# Altium schematic sheet SCH-esp32.SchDoc (part 1 of 3)
size A2; SheetNumber: 1; SheetTotal: 1
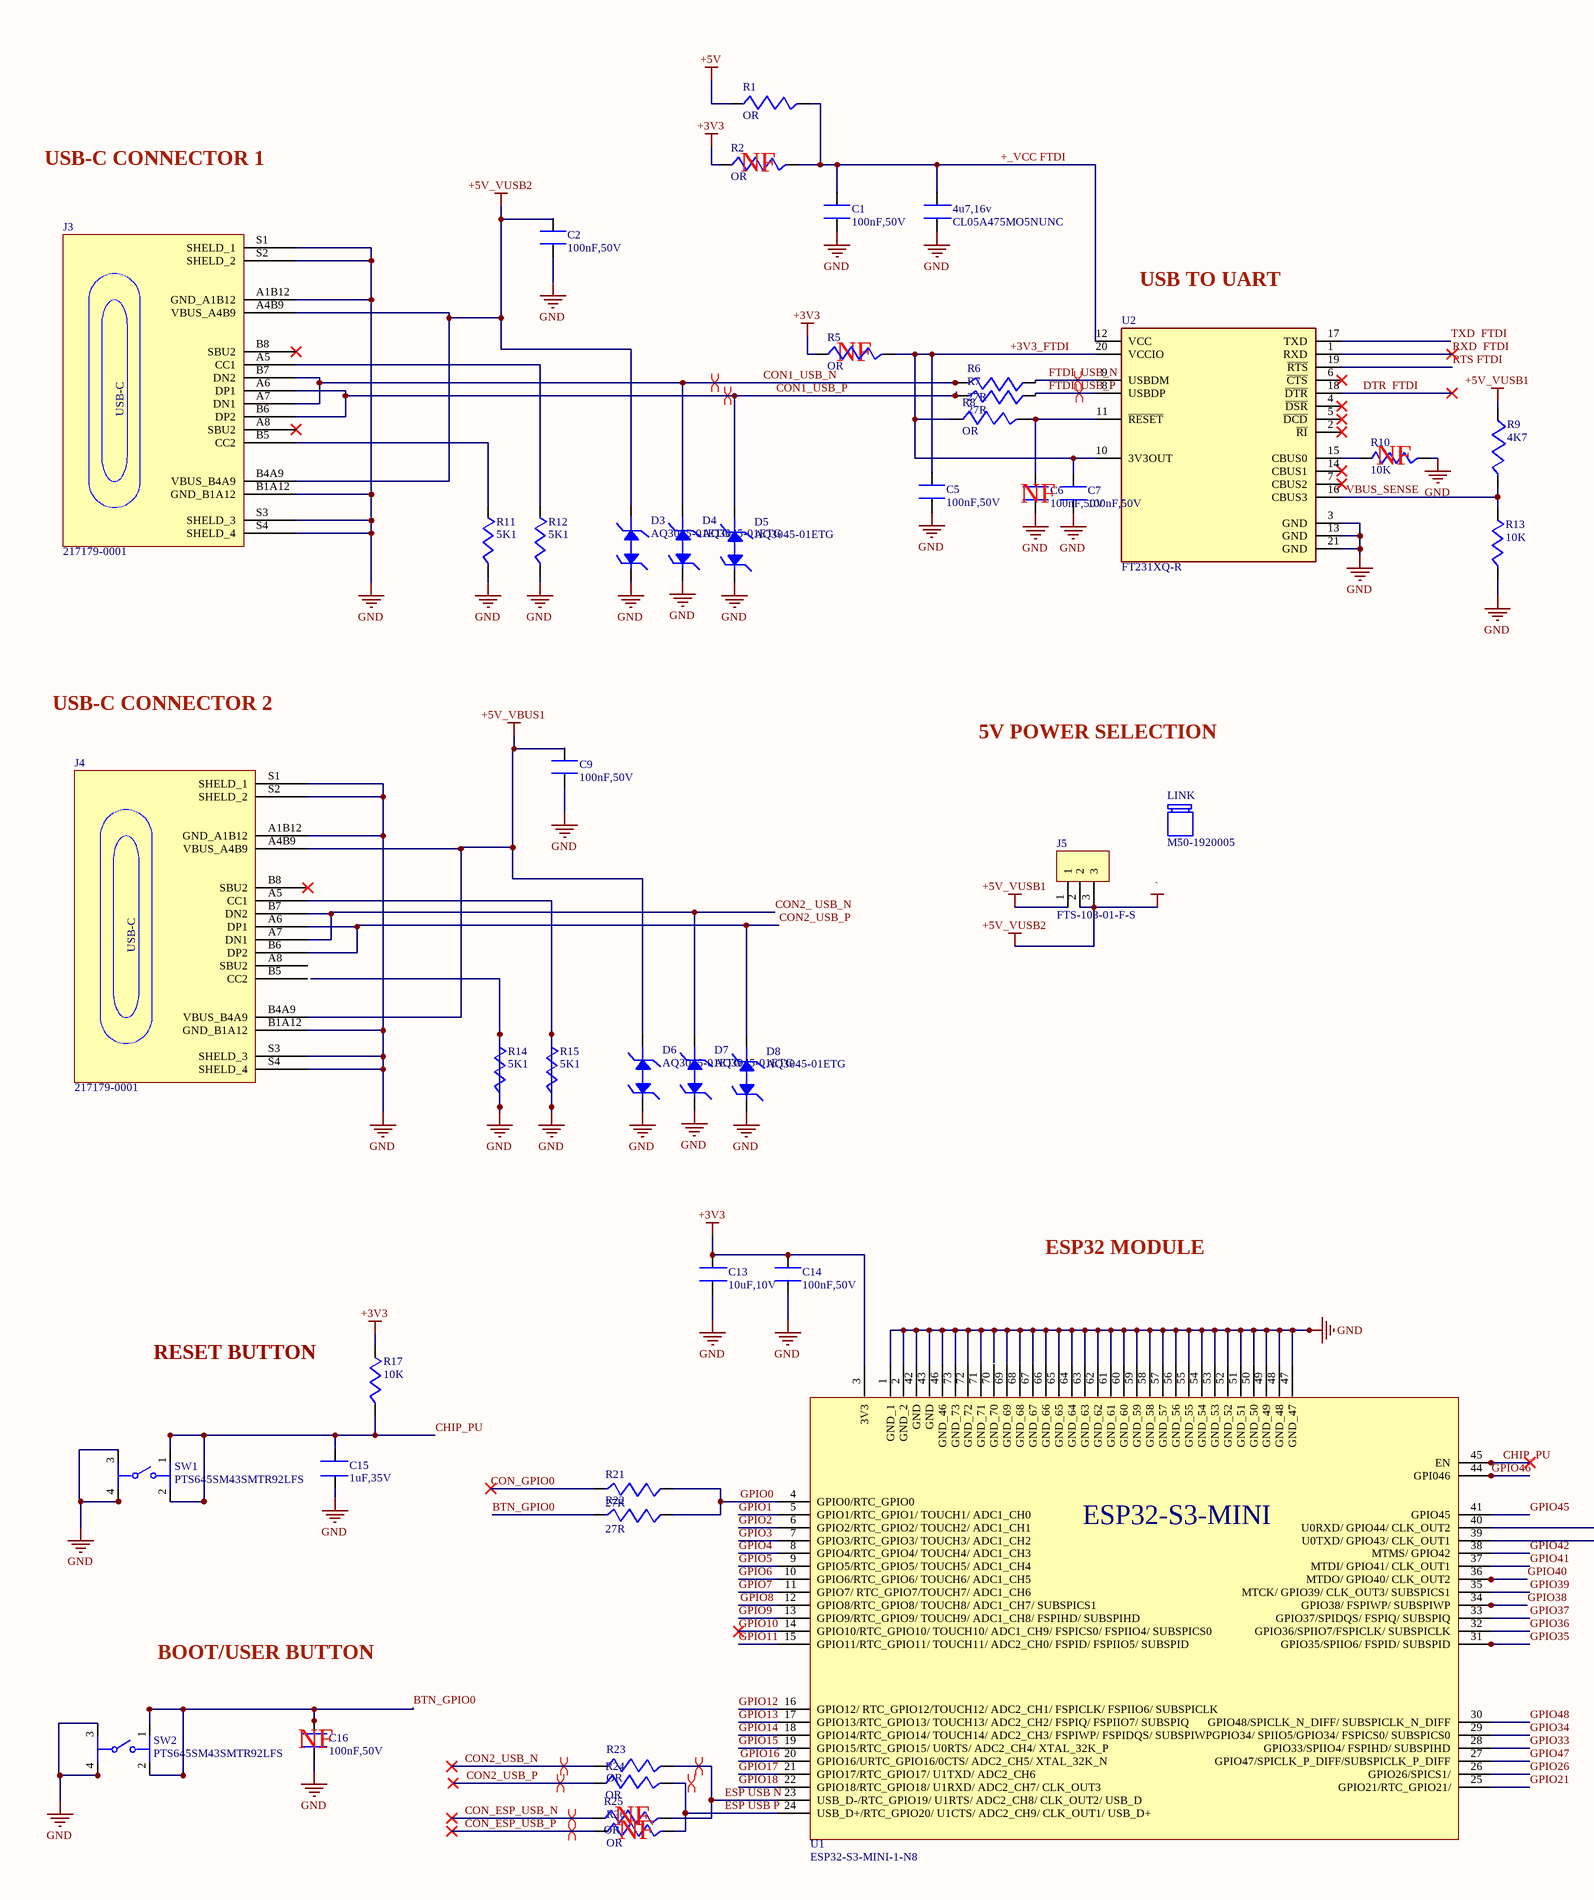
[diagram p0: SCH-esp32.SchDoc, left]
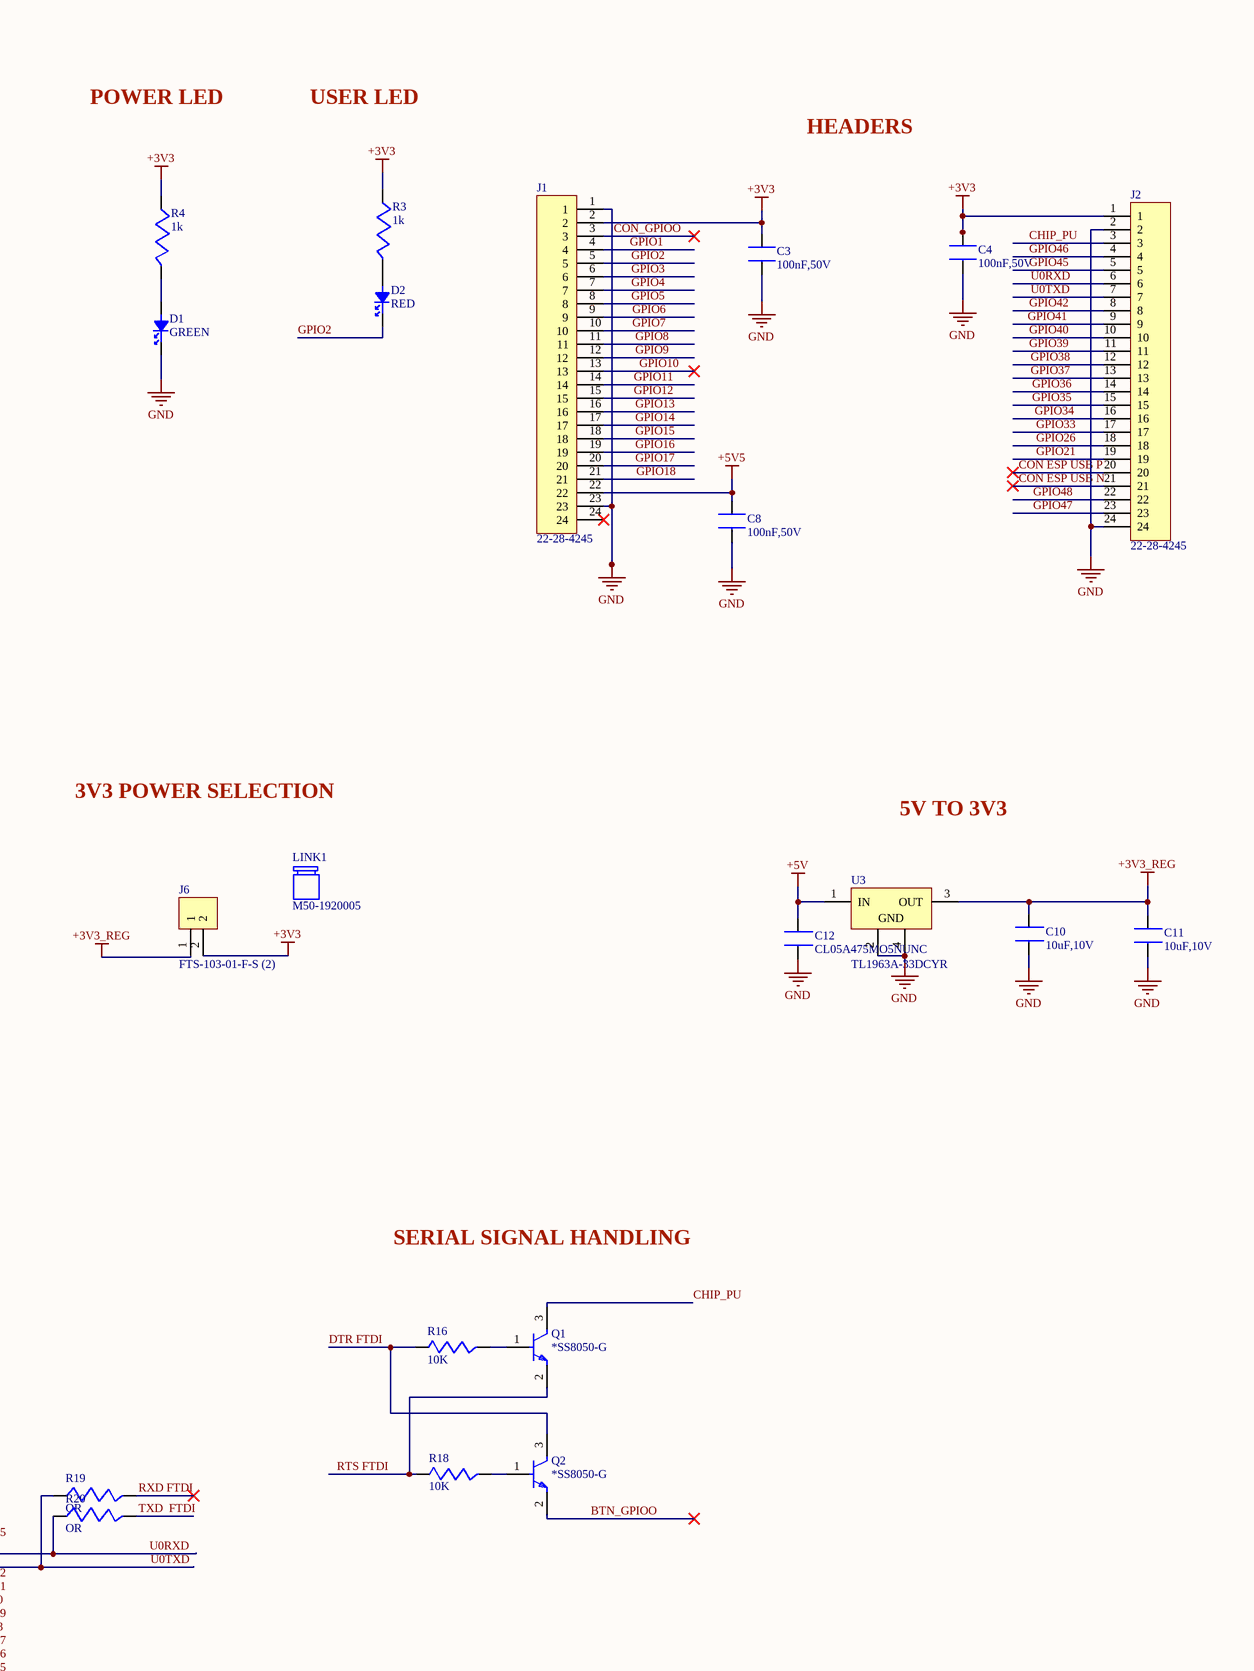
[diagram p1: SCH-esp32.SchDoc, right]

## Parts
4u7,16v  CL05A475MO5NUNC  [CAPC1005X55N]
C1  100nF,50V  [CAPC1005X55N]
C2  100nF,50V  [CAPC1005X55N]
C3  100nF,50V  [CAPC1005X55N]
C4  100nF,50V  [CAPC1005X55N]
C5  100nF,50V  [CAPC1005X55N]
C6  100nF,50V  [CAPC1005X55N]
C7  100nF,50V  [CAPC1005X55N]
C8  100nF,50V  [CAPC1005X55N]
C9  100nF,50V  [CAPC1005X55N]
C10  10uF,10V  [CAPC1005X55N]
C11  10uF,10V  [CAPC1005X55N]
C12  CL05A475MO5NUNC  [CAPC1005X55N]
C13  10uF,10V  [CAPC1005X55N]
C14  100nF,50V  [CAPC1005X55N]
C15  1uF,35V  [CAPC1005X55N]
C16  100nF,50V  [CAPC1005X55N]
D1  GREEN  [LED0402G]
D2  RED  [LED0402R]
D3  AQ3045-01ETG  [SOD882]
D4  AQ3045-01ETG  [SOD882]
D5  AQ3045-01ETG  [SOD882]
D6  AQ3045-01ETG  [SOD882]
D7  AQ3045-01ETG  [SOD882]
D8  AQ3045-01ETG  [SOD882]
J1  22-28-4245  [HDR_1X24_2.54MM]
J2  22-28-4245  [HDR_1X24_2.54MM]
J3  217179-0001  [FP-2171790001-MFG]
J4  217179-0001  [FP-2171790001-MFG]
J5  FTS-103-01-F-S  [HDR_1X3_1.27MM]
J6  FTS-103-01-F-S (2)  [HDR_1X2_1.27MM]
LINK  M50-1920005
LINK1  M50-1920005
Q1  *SS8050-G  [FP-SS8050-G-IPC_B]
Q2  *SS8050-G  [FP-SS8050-G-IPC_B]
R1  OR  [RESC1005X37N]
R2  OR  [RESC1005X37N]
R3  1k  [RESC1005X37N]
R4  1k  [RESC1005X37N]
R5  OR  [RESC1005X37N]
R6  27R  [RESC1005X37N]
R7  27R  [RESC1005X37N]
R8  OR  [RESC1005X37N]
R9  4K7  [RESC1005X37N]
R10  10K  [RESC1005X37N]
R11  5K1  [RESC1005X37N]
R12  5K1  [RESC1005X37N]
R13  10K  [RESC1005X37N]
R14  5K1  [RESC1005X37N]
R15  5K1  [RESC1005X37N]
R16  10K  [RESC1005X37N]
R17  10K  [RESC1005X37N]
R18  10K  [RESC1005X37N]
R19  OR  [RESC1005X37N]
R20  OR  [RESC1005X37N]
R21  27R  [RESC1005X37N]
R22  27R  [RESC1005X37N]
R23  OR  [RESC1005X37N]
R24  OR  [RESC1005X37N]
R25  OR  [RESC1005X37N]
R26  OR  [RESC1005X37N]
SW1  PTS645SM43SMTR92LFS  [FP-PTS645SH50SMTR92LFS-MFG]
SW2  PTS645SM43SMTR92LFS  [FP-PTS645SH50SMTR92LFS-MFG]
U1  ESP32-S3-MINI-1-N8  [XCVR_ESP32-S3-MINI-1-N8 - duplicate]
U2  FT231XQ-R  [FP-QFN-20-IPC_B]
U3  TL1963A-33DCYR  [DCY0004A_N]

## Nets
+3V3: C3.2 C4.2 C13.2 C14.2 J1.2 J2.1 J6.2 R2.2 R3.2 R4.2 R5.2 R17.2 U1.3(3V3)
+3V3_REG: C10.2 C11.2 J6.1 U3.3(OUT)
+5V: C12.2 R1.2 U3.1(IN)
+5V5: C8.2 J1.22
+5V_VBUS1: C9.2 D6.2 J4.A4B9(VBUS_A4B9) J4.B4A9(VBUS_B4A9)
+5V_VUSB1: J5.1 R9.2
+5V_VUSB2: C2.2 D3.2 J3.A4B9(VBUS_A4B9) J3.B4A9(VBUS_B4A9) J5.2 J5.3  [also labelled `]
GND: 4u7,16v.1 C1.1 C2.1 C3.1 C4.1 C5.1 C6.1 C7.1 C8.1 C9.1 C10.1 C11.1 C12.1 C13.1 C14.1 C15.1 C16.1 D1.1 D3.1 D4.1 D5.1 D6.1 D7.1 D8.1 J1.1 J1.23 J2.2 J2.24 J3.A1B12(GND_A1B12) J3.B1A12(GND_B1A12) J3.S1(SHELD_1) J3.S2(SHELD_2) J3.S3(SHELD_3) J3.S4(SHELD_4) J4.A1B12(GND_A1B12) J4.A5(CC1) J4.B1A12(GND_B1A12) J4.S1(SHELD_1) J4.S2(SHELD_2) J4.S3(SHELD_3) J4.S4(SHELD_4) R10.1 R11.1 R12.1 R13.1 R14.1 R14.2 R15.1 R15.2 SW1.3 SW1.4 SW2.3 SW2.4 U1.1(GND_1) U1.2(GND_2) U1.42(GND) U1.43(GND) U1.46(GND_46) U1.47(GND_47) U1.48(GND_48) U1.49(GND_49) U1.50(GND_50) U1.51(GND_51) U1.52(GND_52) U1.53(GND_53) U1.54(GND_54) U1.55(GND_55) U1.56(GND_56) U1.57(GND_57) U1.58(GND_58) U1.59(GND_59) U1.60(GND_60) U1.61(GND_61) U1.62(GND_62) U1.63(GND_63) U1.64(GND_64) U1.65(GND_65) U1.66(GND_66) U1.67(GND_67) U1.68(GND_68) U1.69(GND_69) U1.71(GND_71) U1.72(GND_72) U1.73(GND_73) U2.3(GND) U2.13(GND) U2.21(GND) U3.2(GND) U3.4(GND)
+3V3_FTDI: C5.2 C7.2 R5.1 R8.2 U2.10(3V3OUT) U2.20(VCCIO)
+_VCC FTDI: 4u7,16v.2 C1.2 R1.1 R2.1 U2.12(VCC)
BTN_GPIO0: C16.2 R22.1 SW2.1 SW2.2
BTN_GPIOO: Q2.2(E)
CHIP_PU: C15.2 J2.3 Q1.3(C) R17.1 SW1.1 SW1.2 U1.45(EN)
CON1_USB_N: D4.2 J3.A7(DN1) J3.B7(DN2) R6.1
CON1_USB_P: D5.2 J3.A6(DP1) J3.B6(DP2) R7.1
CON2_ USB_N: D7.2 J4.A7(DN1) J4.B7(DN2)
CON2_USB_N: R23.2
CON2_USB_P: D8.2 J4.A6(DP1) J4.B6(DP2) R24.2
CON ESP USB N: J2.21
CON ESP USB P: J2.20
CON_ESP_USB_N: R25.2
CON_ESP_USB_P: R26.2
CON_GPIO0: R21.1
CON_GPIOO: J1.3
DTR  FTDI: U2.18(~{DTR})
DTR FTDI: Q2.3(C) R16.2
ESP USB N: R23.1 R25.1 U1.23(USB_D-/RTC_GPIO19/_U1RTS/_ADC2_CH8/_CLK_OUT2/_USB_D)
ESP USB P: R24.1 R26.1 U1.24(USB_D+/RTC_GPIO20/_U1CTS/_ADC2_CH9/_CLK_OUT1/_USB_D+)
FTDI_USB_N: R6.2 U2.9(USBDM)
FTDI_USB_P: R7.2 U2.8(USBDP)
GPIO0: R21.2 R22.2 U1.4(GPIO0/RTC_GPIO0)
GPIO1: J1.4 U1.5(GPIO1/RTC_GPIO1/_TOUCH1/_ADC1_CH0)
GPIO2: D2.1 J1.5 U1.6(GPIO2/RTC_GPIO2/_TOUCH2/_ADC1_CH1)
GPIO3: J1.6 U1.7(GPIO3/RTC_GPIO3/_TOUCH3/_ADC1_CH2)
GPIO4: J1.7 U1.8(GPIO4/RTC_GPIO4/_TOUCH4/_ADC1_CH3)
GPIO5: J1.8 U1.9(GPIO5/RTC_GPIO5/_TOUCH5/_ADC1_CH4)
GPIO6: J1.9 U1.10(GPIO6/RTC_GPIO6/_TOUCH6/_ADC1_CH5)
GPIO7: J1.10 U1.11(GPIO7/_RTC_GPIO7/TOUCH7/_ADC1_CH6)
GPIO8: J1.11 U1.12(GPIO8/RTC_GPIO8/_TOUCH8/_ADC1_CH7/_SUBSPICS1)
GPIO9: J1.12 U1.13(GPIO9/RTC_GPIO9/_TOUCH9/_ADC1_CH8/_FSPIHD/_SUBSPIHD)
GPIO10: J1.13 U1.14(GPIO10/RTC_GPIO10/_TOUCH10/_ADC1_CH9/_FSPICS0/_FSPIIO4/_SUBSPICS0)
GPIO11: J1.14 U1.15(GPIO11/RTC_GPIO11/_TOUCH11/_ADC2_CH0/_FSPID/_FSPIIO5/_SUBSPID)
GPIO12: J1.15 U1.16(GPIO12/_RTC_GPIO12/TOUCH12/_ADC2_CH1/_FSPICLK/_FSPIIO6/_SUBSPICLK)
GPIO13: J1.16 U1.17(GPIO13/RTC_GPIO13/_TOUCH13/_ADC2_CH2/_FSPIQ/_FSPIIO7/_SUBSPIQ)
GPIO14: J1.17 U1.18(GPIO14/RTC_GPIO14/_TOUCH14/_ADC2_CH3/_FSPIWP/_FSPIDQS/_SUBSPIWP)
GPIO15: J1.18 U1.19(GPIO15/RTC_GPIO15/_U0RTS/_ADC2_CH4/_XTAL_32K_P)
GPIO16: J1.19 U1.20(GPIO16/URTC_GPIO16/0CTS/_ADC2_CH5/_XTAL_32K_N)
GPIO17: J1.20 U1.21(GPIO17/RTC_GPIO17/_U1TXD/_ADC2_CH6)
GPIO18: J1.21 U1.22(GPIO18/RTC_GPIO18/_U1RXD/_ADC2_CH7/_CLK_OUT3)
GPIO21: J2.19 U1.25(GPIO21/RTC_GPIO21/)
GPIO26: J2.18 U1.26(GPIO26/SPICS1/)
GPIO33: J2.17 U1.28(GPIO33/SPIIO4/_FSPIHD/_SUBSPIHD)
GPIO34: J2.16 U1.29(GPIO34/_SPIIO5/GPIO34/_FSPICS0/_SUBSPICS0)
GPIO35: J2.15 U1.31(GPIO35/SPIIO6/_FSPID/_SUBSPID)
GPIO36: J2.14 U1.32(GPIO36/SPIIO7/FSPICLK/_SUBSPICLK)
GPIO37: J2.13 U1.33(GPIO37/SPIDQS/_FSPIQ/_SUBSPIQ)
GPIO38: J2.12 U1.34(GPIO38/_FSPIWP/_SUBSPIWP)
GPIO39: J2.11 U1.35(MTCK/_GPIO39/_CLK_OUT3/_SUBSPICS1)
GPIO40: J2.10 U1.36(MTDO/_GPIO40/_CLK_OUT2)
GPIO41: J2.9 U1.37(MTDI/_GPIO41/_CLK_OUT1)
GPIO42: J2.8 U1.38(MTMS/_GPIO42)
GPIO45: J2.5 U1.41(GPIO45)
GPIO46: J2.4 U1.44(GPI046)
GPIO47: J2.23 U1.27(GPIO47/SPICLK_P_DIFF/SUBSPICLK_P_DIFF)
GPIO48: J2.22 U1.30(GPIO48/SPICLK_N_DIFF/_SUBSPICLK_N_DIFF)
RTS FTDI: Q1.2(E) R18.2 U2.19(~{RTS})
RXD  FTDI: U2.1(RXD)
RXD FTDI: R19.1
TXD  FTDI: R20.1 U2.17(TXD)
U0RXD: J2.6 R20.2 U1.40(U0RXD/_GPIO44/_CLK_OUT2)
U0TXD: J2.7 R19.2 U1.39(U0TXD/_GPIO43/_CLK_OUT1)
VBUS_SENSE: R9.1 R13.2 U2.16(CBUS3)
NetC6_2: C6.2 R8.1 U2.11(~{RESET})
NetD1_2: D1.2 R4.1
NetD2_2: D2.2 R3.1
NetJ3_A5: J3.A5(CC1) R12.2
NetJ3_B5: J3.B5(CC2) R11.2
NetQ1_1: Q1.1(B) R16.1
NetQ2_1: Q2.1(B) R18.1
NetR10_2: R10.2 U2.15(CBUS0)

Not connected (* = marked no-connect by the designer): J1 24*; J3 A8(_SBU2)* B8(SBU2)*; J4 A8(_SBU2) B5(CC2) B8(SBU2)*; U1 70(GND_70); U2 2(~{RI})* 4(~{DSR})* 5(~{DCD})* 6(~{CTS})* 7(CBUS2)* 14(CBUS1)*

## Layout directives
differential pair; net class DIFF90: CON2_USB_N, CON2_USB_P, CON_ESP_USB_N, CON_ESP_USB_P, ESP USB N, ESP USB P
differential pair: CON1_USB_N, CON1_USB_P, FTDI_USB_N, FTDI_USB_P

## Notes on the sheet
- POWER LED
- USER LED
- USB-C CONNECTOR 1
- (near R2) NF
- HEADERS
- (near U2) USB TO UART
- (near R5) NF
- (near R10) NF
- (near C6) NF
- USB-C CONNECTOR 2
- 5V POWER SELECTION
- 3V3 POWER SELECTION
- 5V TO 3V3
- SERIAL SIGNAL HANDLING
- ESP32 MODULE
- RESET BUTTON
- BOOT/USER BUTTON
- (near C16) NF
- NF
- (in symbol 217179-0001) USB-C
- (in symbol ESP32-S3-MINI-1-N8) ESP32-S3-MINI